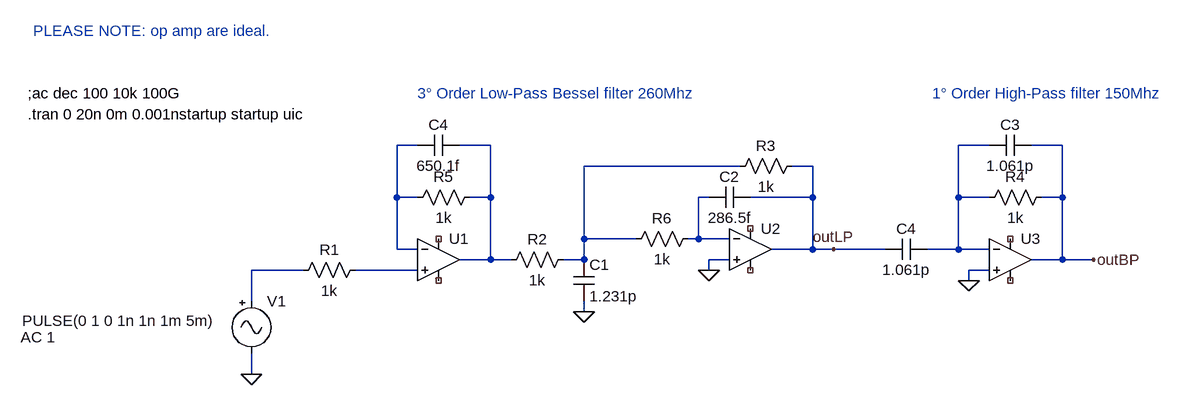
[diagram p0: schematic MFB_3_LP_Bessel_1_HP.asc]
MFB_3_LP_Bessel_1_HP.asc, the LTspice schematic file:
Version 4
SHEET 1 1404 680
WIRE 224 -176 192 -176
WIRE 336 -176 288 -176
WIRE 1104 -176 1056 -176
WIRE 1216 -176 1168 -176
WIRE 720 -144 480 -144
WIRE 832 -144 800 -144
WIRE 192 -96 192 -176
WIRE 224 -96 192 -96
WIRE 336 -96 336 -176
WIRE 336 -96 304 -96
WIRE 672 -96 656 -96
WIRE 832 -96 832 -144
WIRE 832 -96 736 -96
WIRE 1056 -96 1056 -176
WIRE 1104 -96 1056 -96
WIRE 1216 -96 1216 -176
WIRE 1216 -96 1184 -96
WIRE 480 -32 480 -144
WIRE 560 -32 480 -32
WIRE 656 -32 656 -96
WIRE 656 -32 640 -32
WIRE 704 -32 656 -32
WIRE 192 -16 192 -96
WIRE 224 -16 192 -16
WIRE 832 -16 832 -96
WIRE 832 -16 768 -16
WIRE 864 -16 832 -16
WIRE 944 -16 864 -16
WIRE 1056 -16 1056 -96
WIRE 1056 -16 1008 -16
WIRE 1104 -16 1056 -16
WIRE 336 0 336 -96
WIRE 336 0 288 0
WIRE 368 0 336 0
WIRE 480 0 480 -32
WIRE 480 0 448 0
WIRE 704 0 672 0
WIRE 1216 0 1216 -96
WIRE 1216 0 1168 0
WIRE 1264 0 1216 0
WIRE 48 16 -32 16
WIRE 224 16 128 16
WIRE 672 16 672 0
WIRE 1104 16 1072 16
WIRE 1072 32 1072 16
WIRE -32 64 -32 16
WIRE 480 80 480 64
WIRE -32 176 -32 144
FLAG -32 176 0
FLAG 864 -16 outLP
FLAG 1264 0 outBP
FLAG 672 16 0
FLAG 480 80 0
FLAG 1072 32 0
SYMBOL Misc\\signal -32 48 R0
WINDOW 3 -353 46 Left 2
WINDOW 123 -355 71 Left 2
WINDOW 39 0 0 Left 0
SYMATTR Value PULSE(0 1 0 1n 1n 1m 5m)
SYMATTR Value2 AC 1
SYMATTR InstName V1
SYMBOL OpAmps\\UniversalOpamp2 256 0 R0
SYMATTR InstName U1
SYMATTR SpiceModel level1
SYMATTR Value2 Avol=100G GBW=10000G Slew=1000G
SYMATTR SpiceLine2 En=0 Enk=0 In=0 Ink=0 Rin=500Meg Ro=50 Ccm=1f Cdiff=1f
SYMBOL res 144 0 R90
WINDOW 0 0 56 VBottom 2
WINDOW 3 32 56 VTop 2
SYMATTR InstName R1
SYMATTR Value 1k
SYMBOL OpAmps\\UniversalOpamp2 736 -16 R0
SYMATTR InstName U2
SYMATTR SpiceModel level1
SYMATTR Value2 Avol=100G GBW=10000G Slew=1000G
SYMATTR SpiceLine2 En=0 Enk=0 In=0 Ink=0 Rin=500Meg Ro=50 Ccm=1f Cdiff=1f
SYMBOL cap 1008 -32 R90
WINDOW 0 0 32 VBottom 2
WINDOW 3 32 32 VTop 2
SYMATTR InstName C4
SYMATTR Value 1.061p
SYMBOL OpAmps\\UniversalOpamp2 1136 0 R0
SYMATTR InstName U3
SYMATTR SpiceModel level1
SYMATTR Value2 Avol=100G GBW=10000G Slew=1000G
SYMATTR SpiceLine2 En=0 Enk=0 In=0 Ink=0 Rin=500Meg Ro=50 Ccm=1f Cdiff=1f
SYMBOL res 320 -112 R90
WINDOW 0 0 56 VBottom 2
WINDOW 3 32 56 VTop 2
SYMATTR InstName R5
SYMATTR Value 1k
SYMBOL cap 288 -192 R90
WINDOW 0 0 32 VBottom 2
WINDOW 3 32 32 VTop 2
SYMATTR InstName C4
SYMATTR Value 650.1f
SYMBOL res 464 -16 R90
WINDOW 0 0 56 VBottom 2
WINDOW 3 32 56 VTop 2
SYMATTR InstName R2
SYMATTR Value 1k
SYMBOL cap 464 0 R0
SYMATTR InstName C1
SYMATTR Value 1.231p
SYMBOL res 816 -160 R90
WINDOW 0 0 56 VBottom 2
WINDOW 3 32 56 VTop 2
SYMATTR InstName R3
SYMATTR Value 1k
SYMBOL res 656 -48 R90
WINDOW 0 0 56 VBottom 2
WINDOW 3 32 56 VTop 2
SYMATTR InstName R6
SYMATTR Value 1k
SYMBOL cap 736 -112 R90
WINDOW 0 0 32 VBottom 2
WINDOW 3 32 32 VTop 2
SYMATTR InstName C2
SYMATTR Value 286.5f
SYMBOL res 1200 -112 R90
WINDOW 0 0 56 VBottom 2
WINDOW 3 32 56 VTop 2
SYMATTR InstName R4
SYMATTR Value 1k
SYMBOL cap 1168 -192 R90
WINDOW 0 0 32 VBottom 2
WINDOW 3 32 32 VTop 2
SYMATTR InstName C3
SYMATTR Value 1.061p
TEXT -376 -256 Left 2 !;ac dec 100 10k 100G
TEXT -376 -224 Left 2 !.tran 0 20n 0m 0.001nstartup startup uic
TEXT 224 -256 Left 2 ;3° Order Low-Pass Bessel filter 260Mhz
TEXT 1016 -256 Left 2 ;1° Order High-Pass filter 150Mhz
TEXT -368 -352 Left 2 ;PLEASE NOTE: op amp are ideal.

The netlist it stands for:
* MFB_3_LP_Bessel_1_HP.asc
V1 N006 0 PULSE(0 1 0 1n 1n 1m 5m) AC 1
XU1 N007 N001 NC_01 NC_02 N002 level1 Avol=100G GBW=10000G Slew=1000G Ilimit=25m Rail=0 Vos=0 En=0 Enk=0 In=0 Ink=0 Rin=500Meg Ro=50 Ccm=1f Cdiff=1f  ; pins In+ In- V+ V- OUT
R1 N007 N006 1k
XU2 0 N005 NC_03 NC_04 outLP level1 Avol=100G GBW=10000G Slew=1000G Ilimit=25m Rail=0 Vos=0 En=0 Enk=0 In=0 Ink=0 Rin=500Meg Ro=50 Ccm=1f Cdiff=1f  ; pins In+ In- V+ V- OUT
C4 N003 outLP 1.061p
XU3 0 N003 NC_05 NC_06 outBP level1 Avol=100G GBW=10000G Slew=1000G Ilimit=25m Rail=0 Vos=0 En=0 Enk=0 In=0 Ink=0 Rin=500Meg Ro=50 Ccm=1f Cdiff=1f  ; pins In+ In- V+ V- OUT
R5 N002 N001 1k
C4 N002 N001 650.1f
R2 N004 N002 1k
C1 N004 0 1.231p
R3 outLP N004 1k
R6 N005 N004 1k
C2 outLP N005 286.5f
R4 outBP N003 1k
C3 outBP N003 1.061p
;ac dec 100 10k 100G
.tran 0 20n 0m 0.001nstartup startup uic
* 3° Order Low-Pass Bessel filter 260Mhz
* 1° Order High-Pass filter 150Mhz
* PLEASE NOTE: op amp are ideal.
.lib UniversalOpAmp2.lib
.backanno
.end